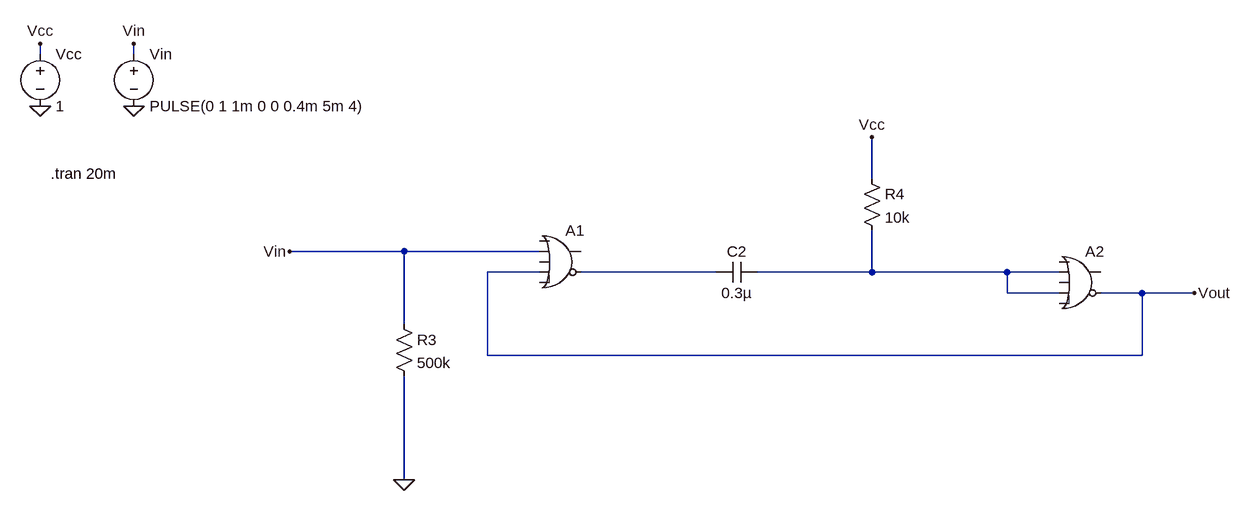
[diagram p0: schematic MNStable_MLTIVibrator_TEST.asc]
MNStable_MLTIVibrator_TEST.asc, the LTspice schematic file:
Version 4
SHEET 1 2420 1144
WIRE -32 368 -32 352
WIRE 112 368 112 352
WIRE 1248 560 1248 496
WIRE 528 672 352 672
WIRE 736 672 528 672
WIRE 736 704 656 704
WIRE 1008 704 800 704
WIRE 1248 704 1248 640
WIRE 1248 704 1072 704
WIRE 1456 704 1248 704
WIRE 1536 704 1456 704
WIRE 1456 736 1456 704
WIRE 1536 736 1456 736
WIRE 1664 736 1600 736
WIRE 1744 736 1664 736
WIRE 528 784 528 672
WIRE 656 832 656 704
WIRE 1664 832 1664 736
WIRE 1664 832 656 832
WIRE 528 1024 528 864
FLAG 112 448 0
FLAG -32 448 0
FLAG 112 352 Vin
FLAG -32 352 Vcc
FLAG 528 1024 0
FLAG 352 672 Vin
FLAG 1248 496 Vcc
FLAG 1744 736 Vout
SYMBOL voltage 112 352 R0
SYMATTR InstName Vin
SYMATTR Value PULSE(0 1 1m 0 0 0.4m 5m 4)
SYMBOL voltage -32 352 R0
SYMATTR InstName Vcc
SYMATTR Value 1
SYMBOL res 512 768 R0
SYMATTR InstName R3
SYMATTR Value 500k
SYMBOL cap 1072 720 M270
WINDOW 0 32 32 VTop 2
WINDOW 3 0 32 VBottom 2
SYMATTR InstName C2
SYMATTR Value 0.3µ
SYMBOL res 1232 544 R0
SYMATTR InstName R4
SYMATTR Value 10k
SYMBOL Digital/or 768 624 R0
SYMATTR InstName A1
SYMBOL Digital/or 1568 656 R0
SYMATTR InstName A2
TEXT -16 552 Left 2 !.tran 20m

The netlist it stands for:
* MNStable_MLTIVibrator_TEST.asc
Vin Vin 0 PULSE(0 1 1m 0 0 0.4m 5m 4)
Vcc Vcc 0 1
R3 Vin 0 500k
C2 N002 N001 0.3µ
R4 Vcc N002 10k
A1 0 Vin 0 Vout 0 N001 0 0 OR
A2 0 N002 0 N002 0 Vout 0 0 OR
.tran 20m
.backanno
.end